# Altium schematic sheet Power.SchDoc: Power Supplies
size Letter; Date: 2017-01-08; DocumentNumber: 6; Revision: A; SheetNumber: 6; SheetTotal: 7; ProjectTitle: SDRdrum Arty Shield; PageSetup: Record=PageOptions|CenterHorizontal=True|CenterVertical=True|PrintScale=0.98|XCorrection=1.00|YCorrection=1.00|PrintKind=2|BorderSize=5000000|LeftOffset=0|BottomOffset=0|Orientation=2|PaperLength=1000|PaperWidth=1000|Scale=100|PaperSource=7|PrintQuality=-3|MediaType=1|DitherType=10|PrintScaleMode=1|PaperKind=Tabloid|PaperIndex=3
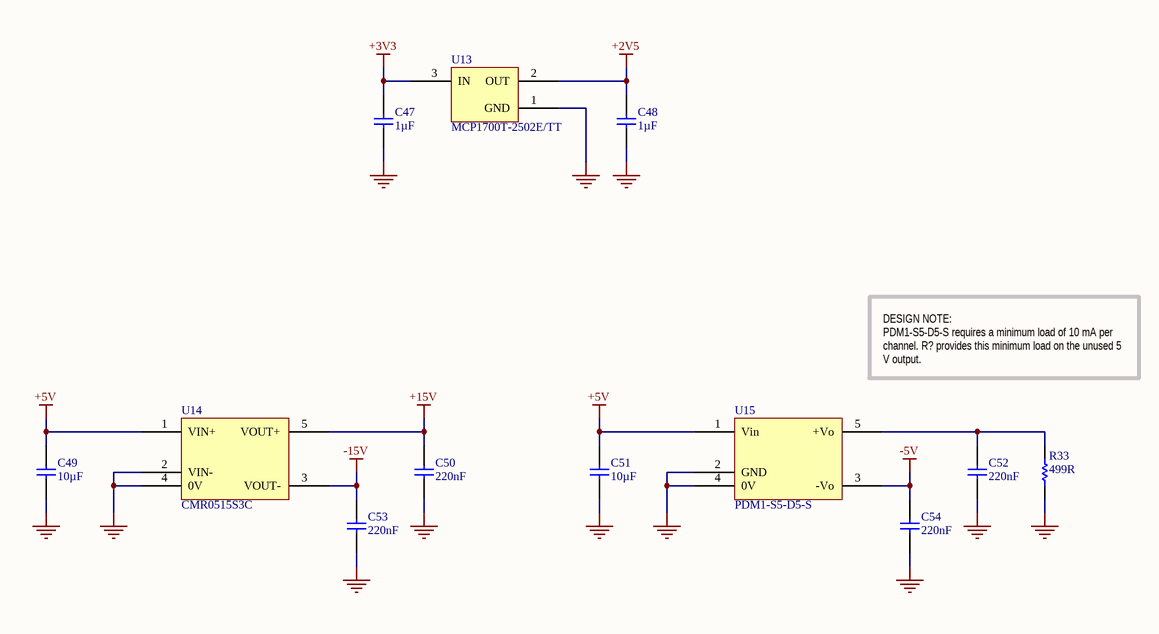
[diagram p0: Power.SchDoc]

## Parts
C47  value 1µF  [CAP-0402-M]  (hidden comment: Capacitor)
C48  value 1µF  [CAP-0402-M]  (hidden comment: Capacitor)
C49  value 10µF  [CAP-0805-M]  (hidden comment: Capacitor)
C50  value 220nF  [CAP-0805-M]  (hidden comment: CAP 220nF ±10% 25V 0805 X7R)
C51  value 10µF  [CAP-0805-M]  (hidden comment: Capacitor)
C52  value 220nF  [CAP-0805-M]  (hidden comment: CAP 220nF ±10% 25V 0805 X7R)
C53  value 220nF  [CAP-0805-M]  (hidden comment: CAP 220nF ±10% 25V 0805 X7R)
C54  value 220nF  [CAP-0805-M]  (hidden comment: CAP 220nF ±10% 25V 0805 X7R)
R33  value 499R  [RES-0603-M]  (hidden comment: RES 499R 1% 1/10 W 0603 ±100ppm/°C)
U13  MCP1700T-2502E/TT  [SOT65P237X110-3N]
U14  CMR0515S3C  [CMR-3C]
U15  PDM1-S5-D5-S  [PDM-1S]

## Nets
+2V5: C48.1 U13.2(OUT)
+3V3: C47.1 U13.3(IN)
+5V: C49.2 C51.2 U14.1(VIN+) U15.1(Vin)
+15V: C50.2 U14.5(VOUT+)
-5V: C54.2 U15.3(-Vo)
-15V: C53.2 U14.3(VOUT-)
GND: C47.2 C48.2 C49.1 C50.1 C51.1 C52.1 C53.1 C54.1 R33.2 U13.1(GND) U14.2(VIN-) U14.4(0V) U15.2(GND) U15.4(0V)
NetC52_2: C52.2 R33.1 U15.5(+Vo)

## Notes on the sheet
- DESIGN NOTE:
  PDM1-S5-D5-S requires a minimum load of 10 mA per channel. R? provides this minimum load on the unused 5 V output.
- Date:
- Revision:
- Sheet:
- /

## Library data of the parts
C47 C48 = CC0402KRX5R6BB105: Manufacturer: Yageo; Manufacturer Series: CC; Tolerance: ±10%; Voltage: 10V; Temperature Coefficient: X5R; Part Number: CC0402KRX5R6BB105; Component Type: Standard; Package: 0402; Temperature Range: -55°C ~ 85°C; Supplier 1: Digi-Key; Supplier Part Number 1: 311-1439-1-ND
C49 C51 = CC0805KKX5R6BB106: Manufacturer: Yageo; Manufacturer Series: CC; Tolerance: ±10%; Voltage: 10V; Temperature Coefficient: X5R; Part Number: CC0805KKX5R6BB106; Component Type: Standard; Package: 0805; Temperature Range: -55°C ~ 85°C; Supplier 1: Digi-Key; Supplier Part Number 1: 311-1460-1-ND
C50 C52-C54 = CC0805KRX7R8BB224: Manufacturer: Yageo; Manufacturer Series: CC; Part Number: CC0805KRX7R8BB224; Component Type: Standard; Tolerance: ±10%; Voltage: 25V; Package: 0805; Temperature Coefficient: X7R; Temperature Range: -55°C ~ 125°C; Supplier 1: Digi-Key; Supplier Part Number 1: 311-1432-1-ND
R33 = RC0603FR-07499RL: Manufacturer: Yageo; Manufacturer Series: RC; Power: 1/10 W; Part Number: RC0603FR-07499RL; Component Type: Standard; Tolerance: 1%; Package: 0603; Temperature Coefficient: ±100ppm/°C; Temperature Range: -55°C ~ 155°C; Supplier 1: Digi-Key; Supplier Part Number 1: 311-499HRCT-ND
U13 = MCP1700T-2502E/TT: Supplier 1: Digi-Key; Supplier Part Number 1: MCP1700T-2502E/TTCT-ND
U14 = CMR0515S3C: Supplier 1: Digi-Key; Supplier Part Number 1: 811-2900-5-ND